# EAGLE schematic power module (EAGLE 5.03)
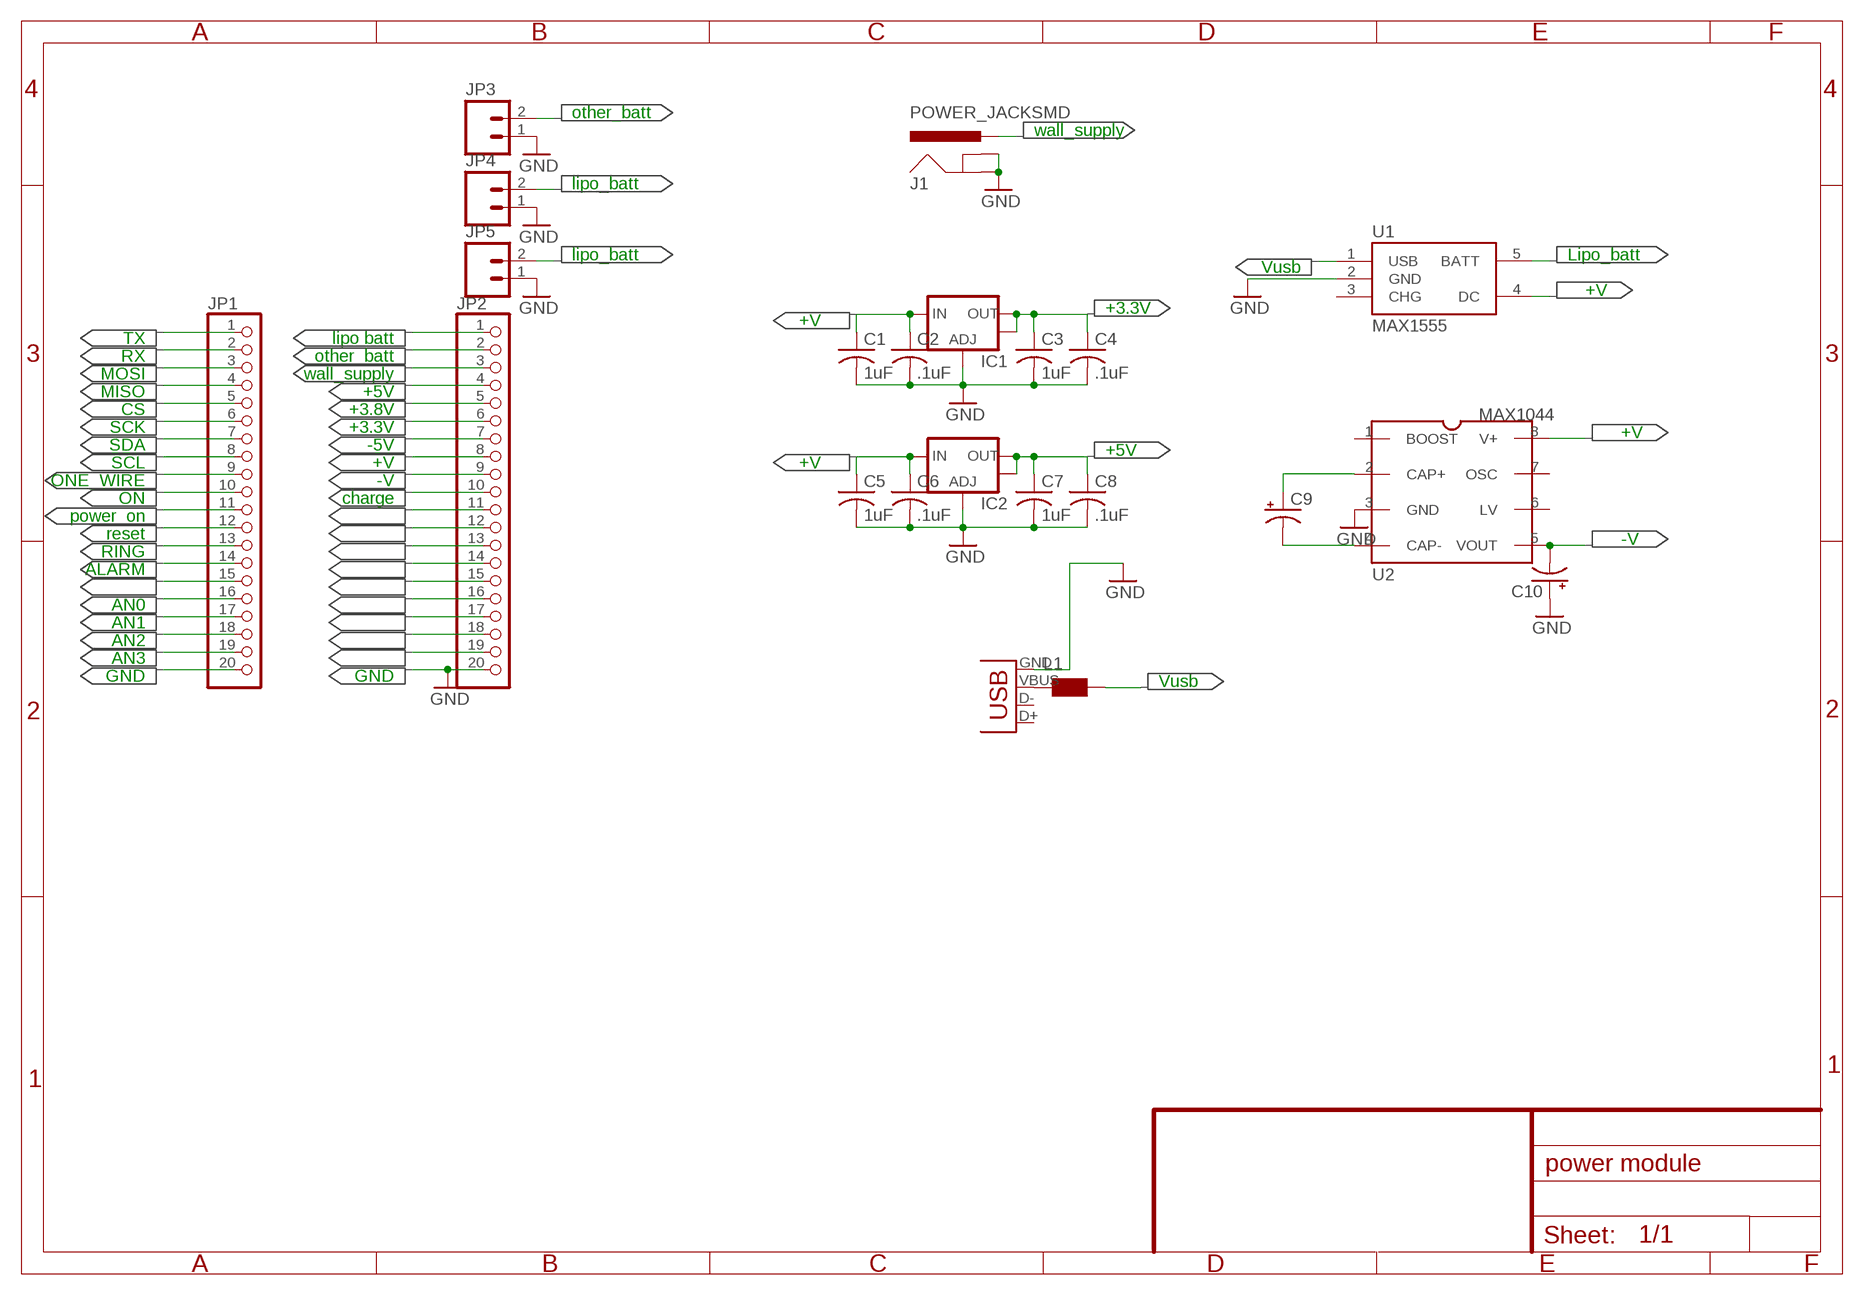
[diagram p0: schematic, sheet 1]

## Parts
C1  1uF  C-USC0603  [C0603]
C2  .1uF  C-USC0603  [C0603]
C3  1uF  C-USC0603  [C0603]
C4  .1uF  C-USC0603  [C0603]
C5  1uF  C-USC0603  [C0603]
C6  .1uF  C-USC0603  [C0603]
C7  1uF  C-USC0603  [C0603]
C8  .1uF  C-USC0603  [C0603]
C9  CPOL-US153CLV-0505  [153CLV-0505]
C10  CPOL-US153CLV-0505  [153CLV-0505]
IC1  V_REG_LM1117SOT223  [SOT223]
IC2  V_REG_LM1117SOT223  [SOT223]
J1  POWER_JACKSMD  [POWER_JACK_SMD]
JP1  PINHD-1X20  [1X20]
JP2  PINHD-1X20  [1X20]
JP3  M023.5MM  [SCREWTERMINAL-3.5MM-2]
JP4  M02POLAR  [MOLEX-1X2]
JP5  M02-JST-2MM-SMT  [S2B-PH]
L1  WE-CBF_0603  [0603]
U1  MAX1555  [SOT23-5]
U2  MAX1044  [SO-8]
X1  USBPTH  [USB-B-PTH]

## Nets
+3.3V: C3.1 C4.1 IC1.2(OUT) IC1.4(OUT) JP2.6
+5V: C7.1 C8.1 IC2.2(OUT) IC2.4(OUT) JP2.4
+V: C1.1 C2.1 C5.1 C6.1 IC1.3(IN) IC2.3(IN) JP2.8 U1.4(DC) U2.8(V+)
-5V: JP2.7
-V: C10.- JP2.9 U2.5(VOUT)
CHARGE: JP2.10
CS: JP1.5
GND: C1.2 C2.2 C3.2 C4.2 C5.2 C6.2 C7.2 C8.2 C10.+ IC1.1(ADJ) IC2.1(ADJ) J1.GND(GNDBREAK) J1.P$4(GND) JP3.1 JP4.1 JP5.1 U1.2(GND) U2.3(GND) X1.GND
LIPO_BATT: JP2.1 JP4.2 JP5.2 U1.5(BATT)
MISO: JP1.4
MOSI: JP1.3
N$2: L1.1 X1.VBUS
N$5: C9.- U2.4(CAP-)
N$8: C9.+ U2.2(CAP+)
ONE_WIRE: JP1.9
OTHER_BATT: JP2.2 JP3.2
RIN: JP1.13
RX: JP1.2
SCK: JP1.6
SCL: JP1.8
SDA: JP1.7
TX: JP1.1
VCC: JP2.5
VUSB: L1.2 U1.1(USB)
WALL_SUPPLY: J1.VIN0(PWR) JP2.3
Unconnected: JP1.10 JP1.11 JP1.12 JP1.14 JP1.15 JP1.16 JP1.17 JP1.18 JP1.19 JP1.20 JP2.11 JP2.12 JP2.13 JP2.14 JP2.15 JP2.16 JP2.17 JP2.18 JP2.19 JP2.20 U1.3(CHG) U2.1(BOOST) U2.6(LV) U2.7(OSC) X1.D+ X1.D-

## Notes on the sheet
- other_batt
- wall_supply
- lipo_batt
- lipo_batt | Vusb | Lipo_batt
- +V
- +V | +3.3V
- TX | lipo batt
- RX | other_batt
- MOSI | wall_supply
- MISO | +5V
- CS | +3.8V
- SCK | +3.3V
- SDA | -5V | +V
- SCL | +V | +V | +5V
- ONE_WIRE | -V
- ON | charge
- power_on
- reset
- RING | -V
- ALARM
- AN0
- AN1
- AN2
- AN3
- GND | GND
- Vusb

## Library data of the parts
C1-C8 = rcl:C-US: CAPACITOR, American symbol
C9 C10 = rcl:CPOL-US: POLARIZED CAPACITOR, American symbol
IC1 IC2 = SparkFun:V_REG_LM1117: Voltage Regulator LM1117 Standard adjustable voltage regulator but in SMD form. Spark Fun Electronics SKU : COM-00595
J1 = SparkFun:POWER_JACK: Power Jack This is the standard 5.5mm barrel jack for power. The PTH is the most common, proven, reliable, footprint. All others are experimental. The Slot footprint only works if the mill layer is transmitted to the PCB fab house so be warned. Spark Fun Electronics SKU : PRT-00119. Mating wall wart : TOL-00298 (and others)
JP1 JP2 = pinhead:PINHD-1X20: PIN HEADER
JP3-JP5 = SparkFun:M02: Header 2 Standard 2-pin 0.1" header. Use with straight break away headers (SKU : PRT-00116), right angle break away headers (PRT-00553), swiss pins (PRT-00743), machine pins (PRT-00117), and female headers (PRT-00115). Molex polarized connector foot print use with SKU : PRT-08233 with associated crimp pins and housings.
L1 = wuerth-elektronik:WE-CBF: SMD EMI Suppression Ferrite Beads - excellent anti-EMI properties - low DCR - impedances till 3000 ohms - rated current up to 6 A
U1 = SparkFun:MAX1555: MAX1555 Lithium Charger IC SOT-23 Lithium Polymer charging IC. Schematic element and footprint proven. Spark Fun Electronics SKU : COM-00674
U2 = nublabs:MAX1044: the max1044 is a negative voltage charge pump generator. Just attach a couple capacitors, and Vout = -Vin
X1 = SparkFun:USB: USB Connectors USB-B-PTH is fully proven SKU : PRT-00139 USB-miniB is fully proven SKU : PRT-00587 USB-A-PCB is untested. USB-A-H is throughly reviewed, but untested. Spark Fun Electronics SKU : PRT-00437 USB-B-SMT is throughly reviewed, but untested. Needs silkscreen touching up. USB-A-S has not been used/tested USB-MB-H has not been used/tested